# EAGLE design monulator-usb-avr8 (EAGLE 5.11)
REVISION: 0.5
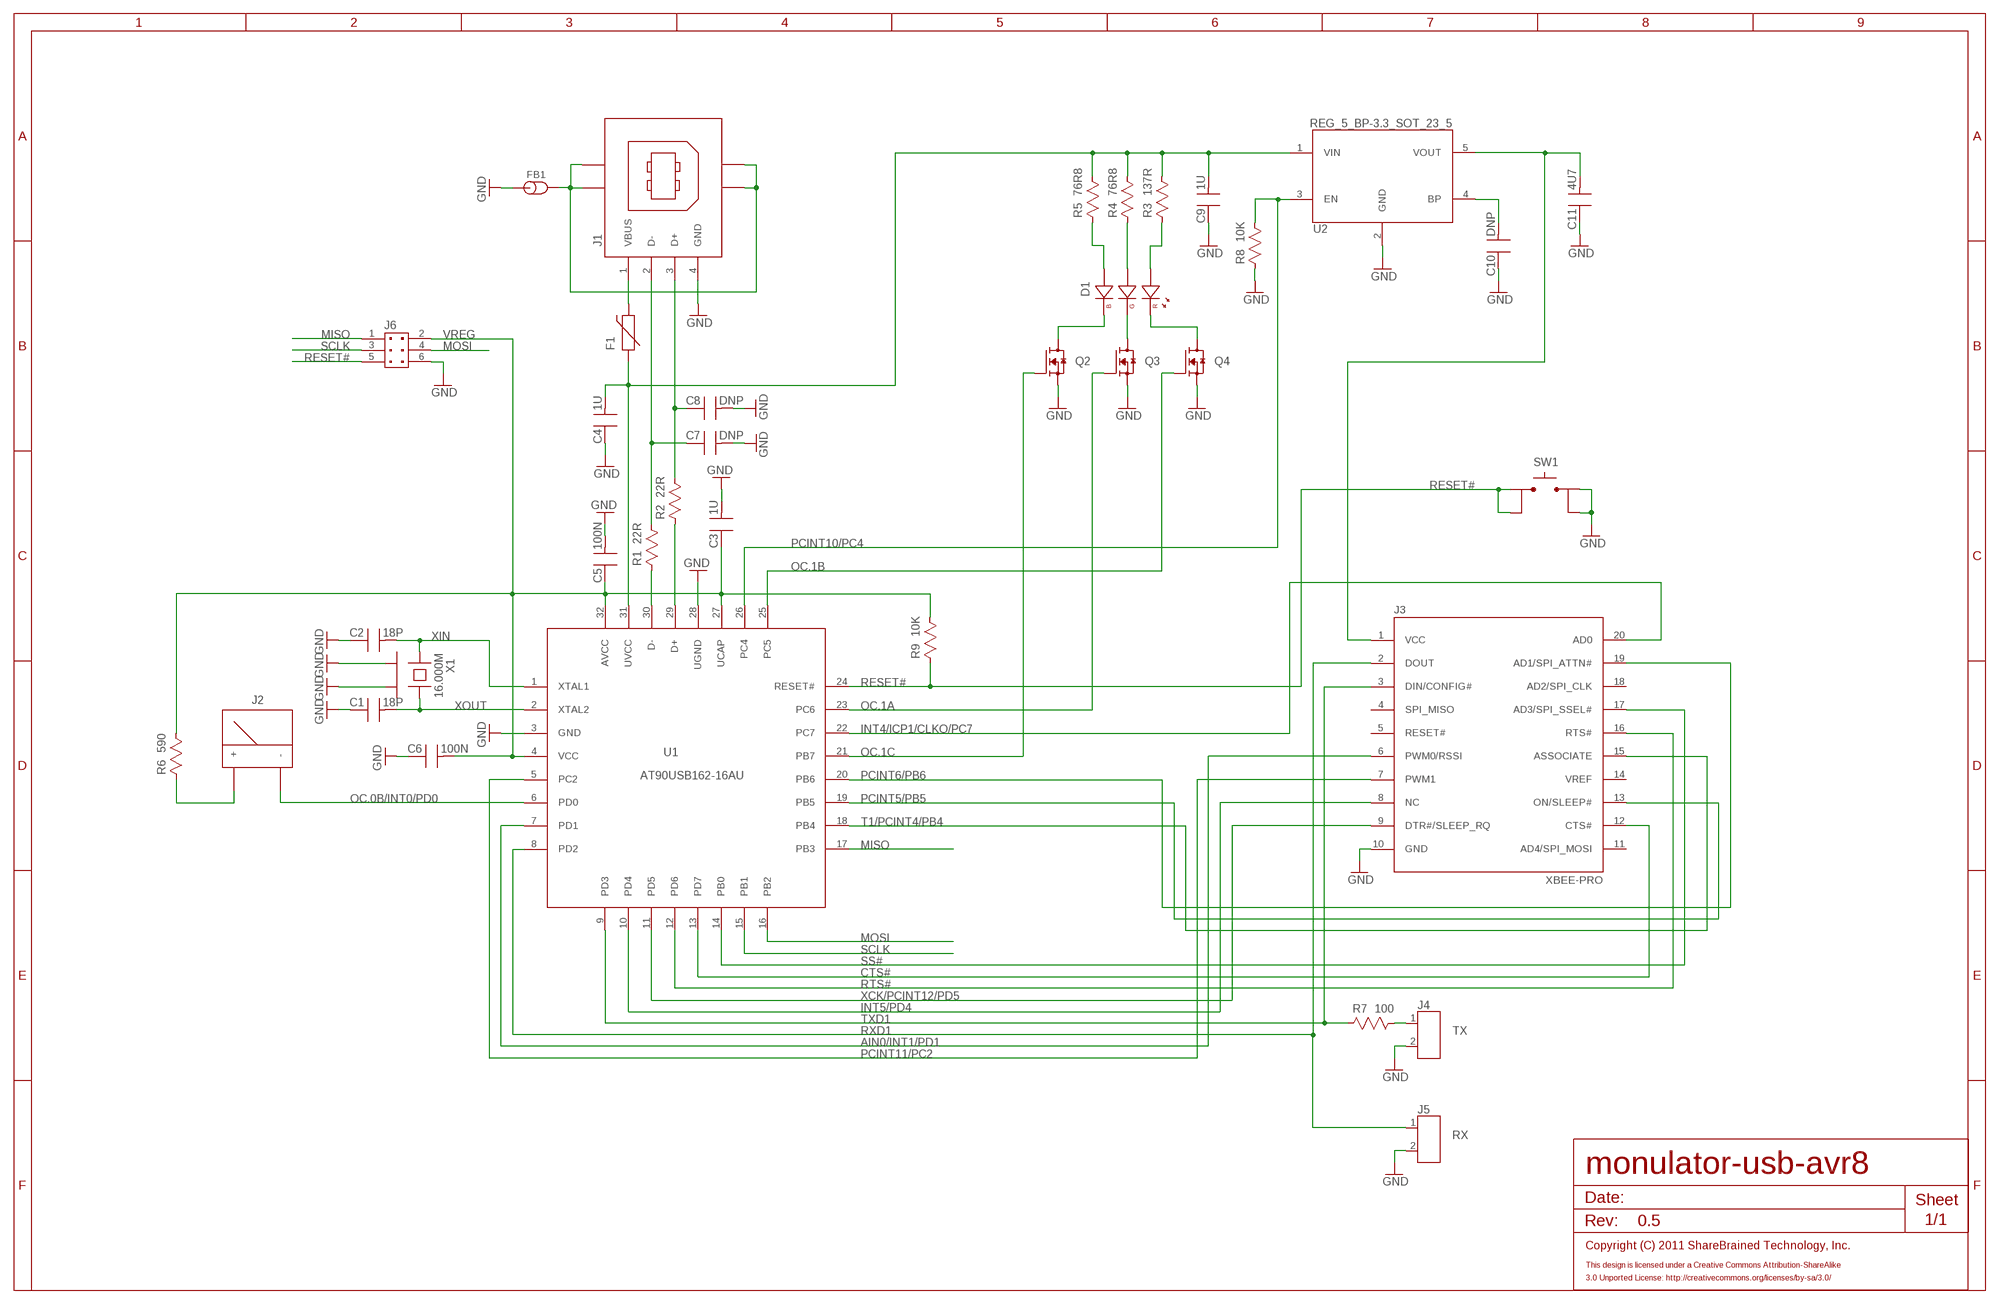
[diagram p0: schematic, sheet 1]

## Parts
C1  18P  C0603_90  [CAPC1608X90N]
C2  18P  C0603_90  [CAPC1608X90N]
C3  1U  C0603_90  [CAPC1608X90N]
C4  1U  C0603_90  [CAPC1608X90N]
C5  100N  C0603_90  [CAPC1608X90N]
C6  100N  C0603_90  [CAPC1608X90N]
C7  DNP  C0603_90  [CAPC1608X90N]
C8  DNP  C0603_90  [CAPC1608X90N]
C9  1U  C0603_90  [CAPC1608X90N]
C10  DNP  C0603_90  [CAPC1608X90N]
C11  4U7  C0603_90  [CAPC1608X90N]
D1  LED_RGB_5060_6  [RGB_LED5060_6]
F1  FUSE_BOURNS_MF-NSMF050  [BOURNS_MF-NSMF]
FB1  FB0603  [INDC1608X95N]
J1  USB_B_WURTH_61400413321  USB_B_OST_USB-B1KS  [USB_B_VERTICAL]
J2  METERETONNET_85C1  [ETONNET_85C1]
J3  XBEE-PRO  [XBEE-PRO]
J4  CON2TH-254  [HEADER254P1X2]
J5  RX  CON2TH-254  [HEADER254P1X2]
J6  HEADER2X3TH-254  [HEADER254P2X3]
Q2  DMN2075U-7  [SOT95P237X117-3N]
Q3  DMN2075U-7  [SOT95P237X117-3N]
Q4  DMN2075U-7  [SOT95P237X117-3N]
R1  22R  R0603_55  [RESC1608X55N]
R2  22R  R0603_55  [RESC1608X55N]
R3  137R  R0603_55  [RESC1608X55N]
R4  76R8  R0603_55  [RESC1608X55N]
R5  76R8  R0603_55  [RESC1608X55N]
R6  590  R0603_55  [RESC1608X55N]
R7  100  R0603_55  [RESC1608X55N]
R8  10K  R0603_55  [RESC1608X55N]
R9  10K  R0603_55  [RESC1608X55N]
SW1  SPST_NO_4PIN  [6X6_SMD]
U1  AT90USB162-16AU  [QFP80P900X900X120-32N]
U2  REG_5_BP-3.3_SOT_23_5  [SOT95P280X110-5N]
X1  16.000M  X_CASE2_NDK_NX3225SA  [OSCCC250X320X70-4N]

## Nets
AIN0/INT1/PD1: J3.6(PWM0/RSSI) U1.7(PD1)
CTS#: J3.12(CTS#) U1.13(PD7)
GND: C1.1 C2.1 C3.2 C4.1 C5.2 C6.1 C7.2 C8.2 C9.1 C10.1 C11.1 FB1.1 J1.4(GND) J3.10(GND) J4.2 J5.2 J6.6 Q2.2(S) Q3.2(S) Q4.2(S) R8.1 SW1.3 SW1.4 U1.3(GND) U1.28(UGND) U2.2(GND) X1.2(CASE) X1.4(CASE)
INT4/ICP1/CLKO/PC7: J3.20(AD0) U1.22(PC7)
INT5/PD4: J3.8(NC) U1.10(PD4)
MISO: J6.1 U1.17(PB3)
MOSI: J6.4 U1.16(PB2)
N$1: C10.2 U2.4(BP)
N$2: R1.1 U1.30(D-)
N$3: R2.1 U1.29(D+)
N$4: C8.1 J1.3(D+) R2.2
N$5: C7.1 J1.2(D-) R1.2
N$6: J4.1 R7.2
N$7: J2.+ R6.1
N$9: D1.3(A_B) R5.1
N$10: D1.2(A_G) R4.1
N$11: D1.1(A_R) R3.1
N$12: D1.4(C_B) Q2.3(D)
N$13: D1.5(C_G) Q3.3(D)
N$14: FB1.2 J1.SHIELD@1(SHIELD) J1.SHIELD@2(SHIELD) J1.SHIELD@3(SHIELD) J1.SHIELD@4(SHIELD)
N$15: D1.6(C_R) Q4.3(D)
N$22: C11.2 J3.1(VCC) U2.5(VOUT)
OC.0B/INT0/PD0: J2.- U1.6(PD0)
OC.1A: Q3.1(G) U1.23(PC6)
OC.1B: Q4.1(G) U1.25(PC5)
OC.1C: Q2.1(G) U1.21(PB7)
PCINT5/PB5: J3.13(ON/SLEEP#) U1.19(PB5)
PCINT6/PB6: J3.19(AD1/SPI_ATTN#) U1.20(PB6)
PCINT10/PC4: R8.2 U1.26(PC4) U2.3(EN)
PCINT11/PC2: J3.7(PWM1) U1.5(PC2)
RESET#: J6.5 R9.1 SW1.1 SW1.2 U1.24(RESET#)
RTS#: J3.16(RTS#) U1.12(PD6)
RXD1: J3.2(DOUT) J5.1 U1.8(PD2)
SCLK: J6.3 U1.15(PB1)
SS#: J3.17(AD3/SPI_SSEL#) U1.14(PB0)
T1/PCINT4/PB4: J3.15(ASSOCIATE) U1.18(PB4)
TXD1: J3.3(DIN/CONFIG#) R7.1 U1.9(PD3)
VREG: C3.1 C5.1 C6.2 J6.2 R6.2 R9.2 U1.4(VCC) U1.27(UCAP) U1.32(AVCC)
VUSB: C4.2 C9.2 F1.1 R3.2 R4.2 R5.2 U1.31(UVCC) U2.1(VIN)
XBUS: F1.2 J1.1(VBUS)
XCK/PCINT12/PD5: J3.9(DTR#/SLEEP_RQ) U1.11(PD5)
XIN: C2.2 U1.1(XTAL1) X1.1
XOUT: C1.2 U1.2(XTAL2) X1.3
Unconnected: J3.4(SPI_MISO) J3.5(RESET#) J3.11(AD4/SPI_MOSI) J3.14(VREF) J3.18(AD2/SPI_CLK)

## Notes on the sheet
- TX
- RX

## Library data of the parts
C1-C11 = capacitor:C
D1 = led:LED_RGB
F1 = fuse:FUSE?*
FB1 = inductor:FB
J1 = usb:USB_B
J2 = meters:METER
J3 = digi:XBEE-PRO
J4 J5 = stake:CON2
J6 = stake:HEADER2X3
Q2-Q4 = mosfet:DMN2075U
R1-R9 = resistor:R
SW1 = switch:SPST_NO_4PIN
U1 = atmel:AT90USB*?AU
U2 = regulator:REG_5_BP-*
X1 = crystal:X_CASE2

## Board
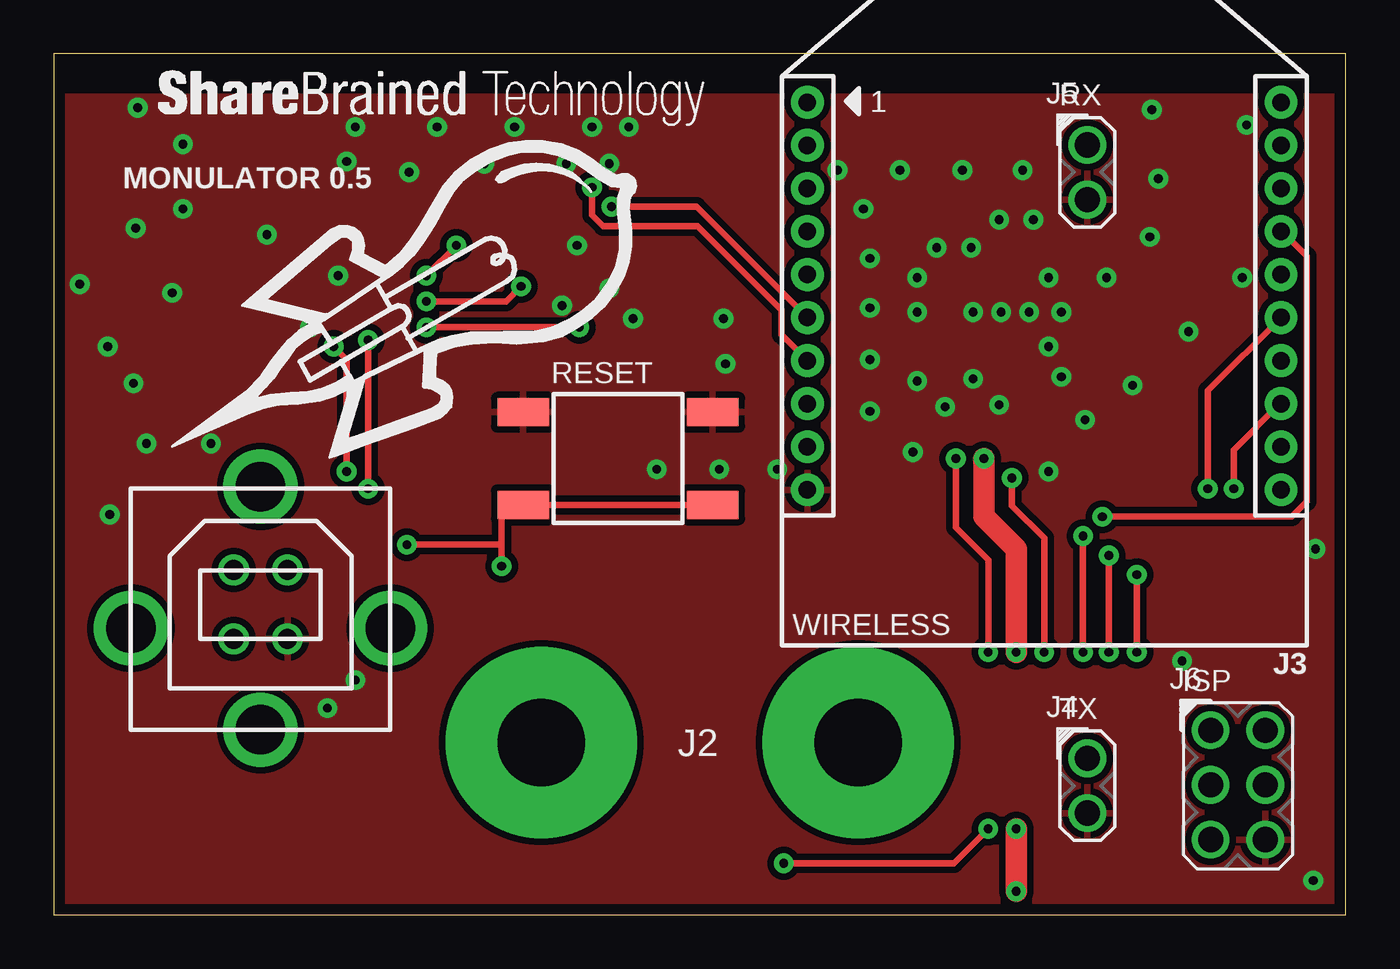
[diagram p1: board, top side]
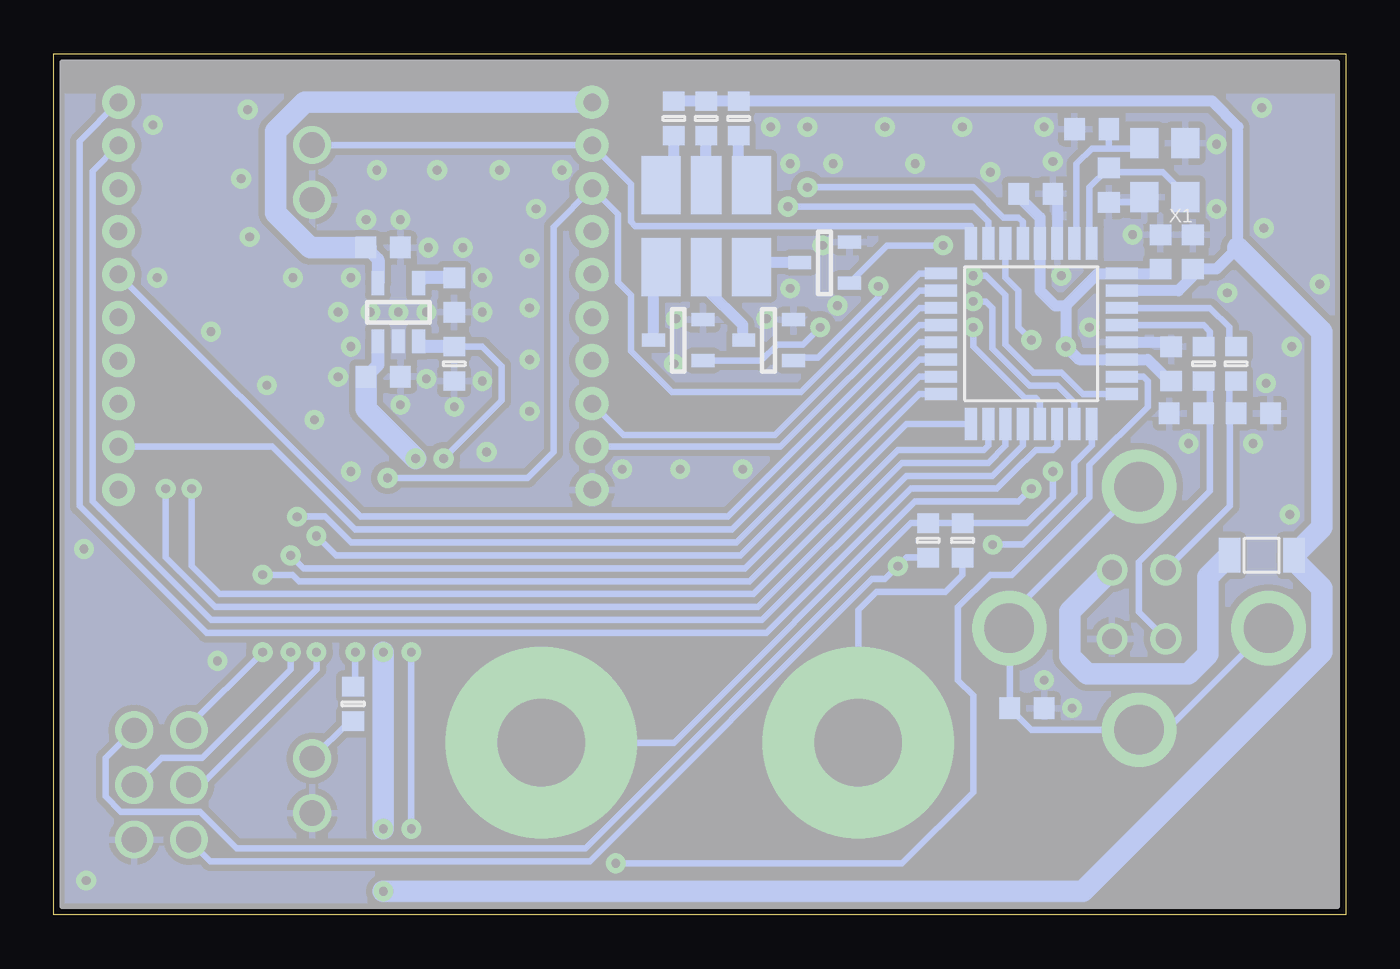
[diagram p2: board, bottom side, seen from below]

Size 60 x 40 mm. Coordinates in mm from the lower left corner, seen from the top.
Outline: 0,0 60,0 60,40 0,40 0,0
Copper layers (1+16): Top 0.0356mm / dielectric 1.5mm / Bottom 0.0356mm
Design rules "laen-two-max *": minimum track width 0.3mm, minimum drill 16mil, track to track 0.25mm, track to pad 0.25mm, pad to pad 0.25mm, via to via 0.25mm, smd to smd 0.25mm, copper to edge 20mil, drill to drill 16mil, minimum pad ring 10mil, minimum via ring 10mil, stop-mask expansion 3mil, vias tented up to drill 16mil, thermal gap 0.3mm

### Footprints (pad centres in the part's own frame; a part is rotated, then mirrored left to right if it is on the bottom)
CAPC1608X90N = smd 0.95 x 1: 1 -0.8,0; 2 0.8,0
RGB_LED5060_6 = smd 2.7 x 1.8: 1 -1.9,2.1; 3 -1.9,-2.1; 4 1.9,-2.1; 6 1.9,2.1 | smd 2.7 x 1.4: 2 -1.9,0; 5 1.9,0
BOURNS_MF-NSMF = smd 1 x 1.6: 1 -1.5,0; 2 1.5,0
INDC1608X95N = smd 0.95 x 1: 1 -0.8,0; 2 0.8,0
USB_B_VERTICAL = drill 0.92 round: 1 1.25,1.82; 2 -1.25,1.82; 3 -1.25,-1.38; 4 1.25,-1.38 | drill 2.3 round: SHIELD@1 -6.02,-0.88; SHIELD@2 6.02,-0.88; SHIELD@3 0,5.7; SHIELD@4 0,-5.6
ETONNET_85C1 = drill 4.064 pad 8.89 round: + -7.366,0; - 7.366,0
XBEE-PRO = drill 0.813 pad 1.524 round: 1 -11,8.75; 2 -11,6.75; 3 -11,4.75; 4 -11,2.75; 5 -11,0.75; 6 -11,-1.25; 7 -11,-3.25; 8 -11,-5.25; 9 -11,-7.25; 10 -11,-9.25; 11 11,-9.25; 12 11,-7.25; 13 11,-5.25; 14 11,-3.25; 15 11,-1.25; 16 11,0.75; 17 11,2.75; 18 11,4.75; 19 11,6.75; 20 11,8.75
HEADER254P1X2 = drill 1.168 round: 1 0,1.27; 2 0,-1.27
HEADER254P2X3 = drill 1.168 round: 1 -1.27,2.58; 2 1.27,2.58; 3 -1.27,0.04; 4 1.27,0.04; 5 -1.27,-2.5; 6 1.27,-2.5
SOT95P237X117-3N = smd 1.05 x 0.6: 1 -1.15,0.95; 2 -1.15,-0.95; 3 1.15,0
RESC1608X55N = smd 0.9 x 1: 1 -0.8,0; 2 0.8,0
6X6_SMD = smd 2.4 x 1.3: 1 -4.4,2.15; 2 4.4,2.15; 3 -4.4,-2.15; 4 4.4,-2.15
QFP80P900X900X120-32N = smd 1.5 x 0.55: 1 -4.2,2.8; 2 -4.2,2; 3 -4.2,1.2; 4 -4.2,0.4; 5 -4.2,-0.4; 6 -4.2,-1.2; 7 -4.2,-2; 8 -4.2,-2.8; 17 4.2,-2.8; 18 4.2,-2; 19 4.2,-1.2; 20 4.2,-0.4; 21 4.2,0.4; 22 4.2,1.2; 23 4.2,2; 24 4.2,2.8 | smd 0.55 x 1.5: 9 -2.8,-4.2; 10 -2,-4.2; 11 -1.2,-4.2; 12 -0.4,-4.2; 13 0.4,-4.2; 14 1.2,-4.2; 15 2,-4.2; 16 2.8,-4.2; 25 2.8,4.2; 26 2,4.2; 27 1.2,4.2; 28 0.4,4.2; 29 -0.4,4.2; 30 -1.2,4.2; 31 -2,4.2; 32 -2.8,4.2
SOT95P280X110-5N = smd 1.1 x 0.6: 1 -1.35,0.95; 2 -1.35,0; 3 -1.35,-0.95; 4 1.35,-0.95; 5 1.35,0.95
OSCCC250X320X70-4N = smd 1.3 x 1.4: 1 -0.95,1.25; 2 -0.95,-1.25; 3 0.95,-1.25; 4 0.95,1.25

### Placement (x,y rotation side)
C1  11.8,36.5 0 bottom
C2  11,33.9 90 bottom
C3  8.1,25.6 90 bottom
C4  7.1,30.8 270 bottom
C5  8.6,30.8 90 bottom
C6  14.4,33.5 180 bottom
C7  4.3,23.3 0 bottom
C8  7.4,23.3 180 bottom
C9  44.7,25 180 bottom
C10  41.4,28.8 90 bottom
C11  44.7,31 180 bottom
D1  29.7,32 270 bottom
F1  3.9,16.7 180 bottom
FB1  14.8,9.6 180 bottom
J1  9.6,14.2 0 top
J2  30,8 0 top
J3  46,29 0 top
J4  48,6 0 top
J5  48,34.5 0 top
J6  55,6 0 top
Q2  31,26.7 180 bottom
Q3  26.8,26.7 180 bottom
Q4  24.2,30.3 180 bottom
R1  5.1,25.6 270 bottom
R2  6.6,25.6 270 bottom
R3  28.2,37 90 bottom
R4  29.7,37 90 bottom
R5  31.2,37 90 bottom
R6  17.8,17.4 90 bottom
R7  46.1,9.8 270 bottom
R8  41.4,25.6 90 bottom
R9  19.4,17.4 90 bottom
SW1  26.2,21.2 180 top
U1  14.6,27 270 bottom
U2  44,28 90 bottom
U$3  [LOGO_BULB_1000_500]  17,29 0 top
U$4  [NAME_1000_500]  17,38 0 top
X1  8.4,34.6 180 bottom

### Tracks (layer width: path | path; a pad name or v marks a point on that pad's centre or on a via)
AIN0/INT1/PD1  (via drill 0.41)
  Top 0.3: v25.9,32.9 29.85,32.9 J3.6
  Bottom 0.3: U1.7 16.6,32.2 17.3,32.9 v25.9,32.9
CTS#
  Bottom 0.3: U1.13 19.8,26.6 28.5,17.9 46,17.9 49.85,21.75 J3.12
GND  (via drill 0.41)
  Bottom 0.3: C2.1 9.6,33.1 X1.4
  Bottom 0.5: U1.3 13.4,33.3 C6.1 | U1.28 8.3,26.6 C3.2
  other vias: 6,35.8 13.6,35 13.2,29.7 9.9,31.6 11.9,27.3 24.3,31.1 31.1,27.7 26.9,27.7 4.3,21.9 7.3,21.9 14,36.6 26.7,36.6 25.8,34.9 25,36.6 23.8,34.9 23.6,28.3 25.8,29.1 31.2,25.6 33.6,20.7 28,20.7 30.9,20.7 58.5,1.6 58.6,17 52.4,11.8 3.7,24.7 5.5,28.9 6,32.8 3.9,37.5 3.8,31.9 1.2,29.3 21.4,36.6 17.8,36.6 16.5,34.5 20,34.9 44,28 42.7,28 45.3,28 42.6,31 40.1,28 42.7,24.9 40.1,24.8 43.9,23.7 41.4,23.6 43.9,32.3 46.8,28 46.2,26.4 46.2,29.6 46.8,25 45.5,32.3 40.1,29.6 41,31 12.7,9.6 14,10.9 2.6,18.6 2.5,26.4 36.4,34.6 37.6,32.8 37.9,30.5 37.9,28.2 37.9,25.8 37.9,23.4 39.9,21.5 39.3,34.6 42.2,34.6 45,34.6 48.9,29.6 50.9,31.5 51.3,34.2 51,37.4 55.4,36.7 55.2,29.6 52.7,27.1 50.1,24.6 46.2,20.6 47.9,23
  pour Bottom (isolate 0.3, rank 2): 0,0 0,38 60,38 60,0
  pour Top (isolate 0.3): 0,0 0,38 60,38 60,0
INT4/ICP1/CLKO/PC7
  Bottom 0.3: U1.22 13.4,21.8 13.6,21.6 14.4,21.6 15.4,20.6 16.2,19.8 20.2,19.8 26.9,13.1 52.9,13.1 58.8,19 58.8,35.95 J3.20
INT5/PD4
  Bottom 0.3: U1.10 19.8,29 26.5,22.3 33.55,22.3 J3.8
MISO  (via drill 0.41)
  Top 0.3: v50.3,15.8 v50.3,12.2
  Bottom 0.3: U1.17 20.4,22.8 27.7,15.5 48.6,15.5 48.9,15.8 v50.3,15.8 | J6.1 53.73,8.77 v50.3,12.2
MOSI  (via drill 0.41)
  Top 0.3: v49,16.7 v49,12.2
  Bottom 0.3: U1.16 19.8,24.2 27.9,16.1 48.4,16.1 v49,16.7 | J6.4 55,7.3 53.1,7.3 49,11.4 v49,12.2
N$1
  Bottom 0.6: C10.2 42.8,29.6 U2.4
N$2
  Bottom 0.3: R1.1 5.4,26.4 5.4,27.3 6.3,28.2 U1.30
N$3
  Bottom 0.3: R2.1 6.3,26.4 6.3,27.1 6.6,27.4 U1.29
N$4
  Bottom 0.3: J1.3 9.6,14.07 9.6,16.4 6.3,19.7 6.3,23.3 | R2.2 6.3,24.8 6.3,23.3 | C8.1 6.3,23.3
N$5
  Bottom 0.3: J1.2 5.39,18.98 5.39,23.3 | R1.2 5.4,24.8 5.4,23.3 5.39,23.3 | C7.1 5.39,23.3
N$6
  Bottom 0.3: R7.2 46.27,9 J4.1
N$7
  Bottom 0.3: J2.+ 22.63,14.17 21.8,15 18.6,15 17.8,15.8 R6.1
N$9
  Bottom 0.5: R5.1 31.2,34.5 D1.3
N$10
  Bottom 0.5: D1.2 R4.1
N$11
  Bottom 0.5: R3.1 28.2,34.5 D1.1
N$12
  Bottom 0.5: Q2.3 32.15,29.75 D1.4
N$13
  Bottom 0.5: D1.5 29.7,29.1 28,27.4 28,26.75 Q3.3
N$14
  Bottom 0.3: J1.SHIELD@3 15.62,13.88 J1.SHIELD@2 15.6,13.3 FB1.2 14.6,8.6 J1.SHIELD@4 8.3,8.6 J1.SHIELD@1
N$15
  Bottom 0.5: Q4.3 27.4,30.3 D1.6
N$22
  Bottom 0.6: U2.5 44.95,30.45 C11.2
  Bottom 1: J3.1 48.35,37.75 49.7,36.4 49.7,32.6 48.1,31 C11.2
OC.0B/INT0/PD0  (via drill 0.41)
  Top 0.3: v14.6,26.7 v14.6,19.8
  Bottom 0.3: U1.6 15.8,29.6 15.2,29 15.2,27.3 v14.6,26.7 | J2.- 31.2,8 20,19.2 15.2,19.2 v14.6,19.8
OC.1A  (via drill 0.41)
  Top 0.3: v17.3,28.5 21,28.5 v21.7,29.2
  Bottom 0.3: U1.23 12.6,23.8 13.4,24.6 14.7,24.6 16.4,26.3 16.4,28.2 16.7,28.5 v17.3,28.5 | v21.7,29.2 21.7,28.7 24.5,25.9 25.5,25.9 Q3.1
OC.1B  (via drill 0.41)
  Top 0.3: v18.7,31.1 v17.3,29.7
  Bottom 0.3: U1.25 12.2,24.2 13.2,25.2 14.5,25.2 15.8,26.5 15.8,28.8 16.7,29.7 v17.3,29.7 | v18.7,31.1 21.3,31.1 Q4.1
OC.1C  (via drill 0.41)
  Top 0.3: v24.4,27.3 v17.3,27.3
  Bottom 0.3: Q2.1 27.15,25.75 26.4,26.5 25.2,26.5 v24.4,27.3 | v17.3,27.3 17.3,26.4 14.9,24 14.4,24 14.2,23.8 U1.21
PCINT5/PB5  (via drill 0.41)
  Top 0.3: J3.13 56.95,23.75 54.8,21.6 v54.8,19.8
  Bottom 0.3: U1.19 15.8,21.8 16.6,21 20.6,21 27.3,14.3 52.5,14.3 54.8,16.6 v54.8,19.8
PCINT6/PB6
  Bottom 0.3: U1.20 15,21.8 16.4,20.4 20.4,20.4 27.1,13.7 52.7,13.7 58.2,19.2 58.2,34.55 J3.19
PCINT10/PC4  (via drill 0.41)
  Top 0.3: v43.4,12.2 43.4,16.5 41.9,18 v41.9,21.2 | v33.9,2.4 41.8,2.4 v43.4,4
  Bottom 0.3: R8.2 40.1,26.4 39.2,25.5 39.2,23.9 v41.9,21.2 | U1.26 9.4,25 9.2,24.8 9.2,23.6 11.9,20.9 11.9,19.4 15.5,15.8 16.5,15.8 18,14.3 18,10.9 17.3,10.2 17.3,5.7 20.6,2.4 v33.9,2.4 | v43.4,4 v43.4,12.2
  Bottom 0.6: R8.2 42.8,26.4 U2.3
PCINT11/PC2  (via drill 0.41)
  Top 0.3: v25,33.8 25,32.5 25.5,32 29.9,32 33.8,28.1 33.8,26.95 J3.7
  Bottom 0.3: U1.5 15,32.2 15.2,32.4 15.9,32.4 17.3,33.8 v25,33.8
RESET#  (via drill 0.41)
  Top 0.3: SW1.1 SW1.2 20.8,19.05 20.8,17.2 | 20.8,17.2 v20.8,16.2 | 20.8,17.2 v16.4,17.2
  Bottom 0.3: U1.24 11.8,21.8 12.6,21 12.6,19.6 15,17.2 v16.4,17.2 | J6.5 52.73,2.5 35.1,2.5 22,15.6 21.4,15.6 v20.8,16.2 20.4,16.6 R9.1
RTS#
  Bottom 0.3: U1.12 19.8,27.4 28.7,18.5 45.75,18.5 J3.16
RXD1
  Bottom 0.3: U1.8 17.4,32 33,32 33.2,32.2 33.2,33.95 J3.2 47.98,35.75 J5.1
SCLK  (via drill 0.41)
  Top 0.3: v47.8,17.6 v47.8,12.2
  Bottom 0.3: U1.15 19.8,25 28.1,16.7 46.9,16.7 v47.8,17.6 | J6.3 53.16,6.04 47.8,11.4 v47.8,12.2
SS#  (via drill 0.41)
  Top 0.3: J3.17 57.05,31.75 58.2,30.6 58.2,19.2 57.5,18.5 v48.7,18.5
  Bottom 0.3: U1.14 19.8,25.8 28.3,17.3 46.2,17.3 47.4,18.5 v48.7,18.5
T1/PCINT4/PB4  (via drill 0.41)
  Top 0.3: J3.15 53.6,24.35 v53.6,19.8
  Bottom 0.3: U1.18 16.6,21.8 16.8,21.6 20.8,21.6 27.5,14.9 52.3,14.9 53.6,16.2 v53.6,19.8
TXD1  (via drill 0.41)
  Top 0.3: v46,12.2 46,17.5 44.5,19 v44.5,20.3
  Bottom 0.3: U1.9 19.8,29.8 25.3,24.3 31.3,24.3 33.2,26.2 33.2,28.8 33.8,29.4 33.8,32.55 J3.3 36.8,31.95 36.8,21.5 38,20.3 v44.5,20.3 | v46,12.2 46,10.7 R7.1
VREG  (via drill 0.41)
  Top 0.3: v13.6,20.6 13.6,25.8 v13,26.4
  Bottom 0.3: J6.2 56.32,8.58 57.6,7.3 57.6,5.5 56.9,4.8 53.2,4.8 51.5,3.1 35.3,3.1 20.2,18.2 R9.2 R6.2 14.8,18.2 13.6,19.4 v13.6,20.6
  Bottom 0.5: C6.2 15.2,33.4 14.2,32.4 U1.4 14.2,29 13.5,28.3 13,28.3 | 13,28.3 11.5,29.8 U1.32 8.8,29.8 C5.1 | C3.1 8.2,24.8 9.2,25.8 U1.27 12.4,25.8 v13,26.4 13,28.3
VUSB  (via drill 0.41)
  Top 1: v44.7,12.2 44.7,17 43.2,18.5 v43.2,21.2 | v44.7,4 v44.7,1.1
  Bottom 0.5: U1.31 7.77,29 7.1,29.67 C4.2 6,30 5,31 5,36.6 6.2,37.8 R3.2 R4.2 R5.2
  Bottom 0.6: U2.1 44.95,25.55 C9.2
  Bottom 1: 5,31 1.1,27.1 1.1,18 F1.1 2.4,16.5 1.1,15.2 1.1,12.2 12.2,1.1 v44.7,1.1 | C9.2 45.5,23.5 v43.2,21.2 | v44.7,4 v44.7,12.2
XBUS
  Bottom 1: J1.1 10.88,16.02 12.8,14.1 12.8,12 12,11.2 7.3,11.2 6.4,12.1 6.4,15.7 F1.2
XCK/PCINT12/PD5
  Bottom 0.3: U1.11 19.8,28.2 26.25,21.75 J3.9
XIN
  Bottom 0.3: X1.1 7.45,33.45 8.5,34.5 10.8,34.5 C2.2 11.9,33.8 11.9,31.2 U1.1
XOUT
  Bottom 0.3: U1.2 12.5,31.2 12.5,34.9 11.8,35.6 11,35.6 | 11,35.6 9.6,35.6 X1.3 | C1.2 11,35.6

### Text on the board
tPlace: RX | 1 | MONULATOR 0.5 | RESET | WIRELESS | ISP | TX